# Altium project TE0723.PrjPCB (part 2 of 2)
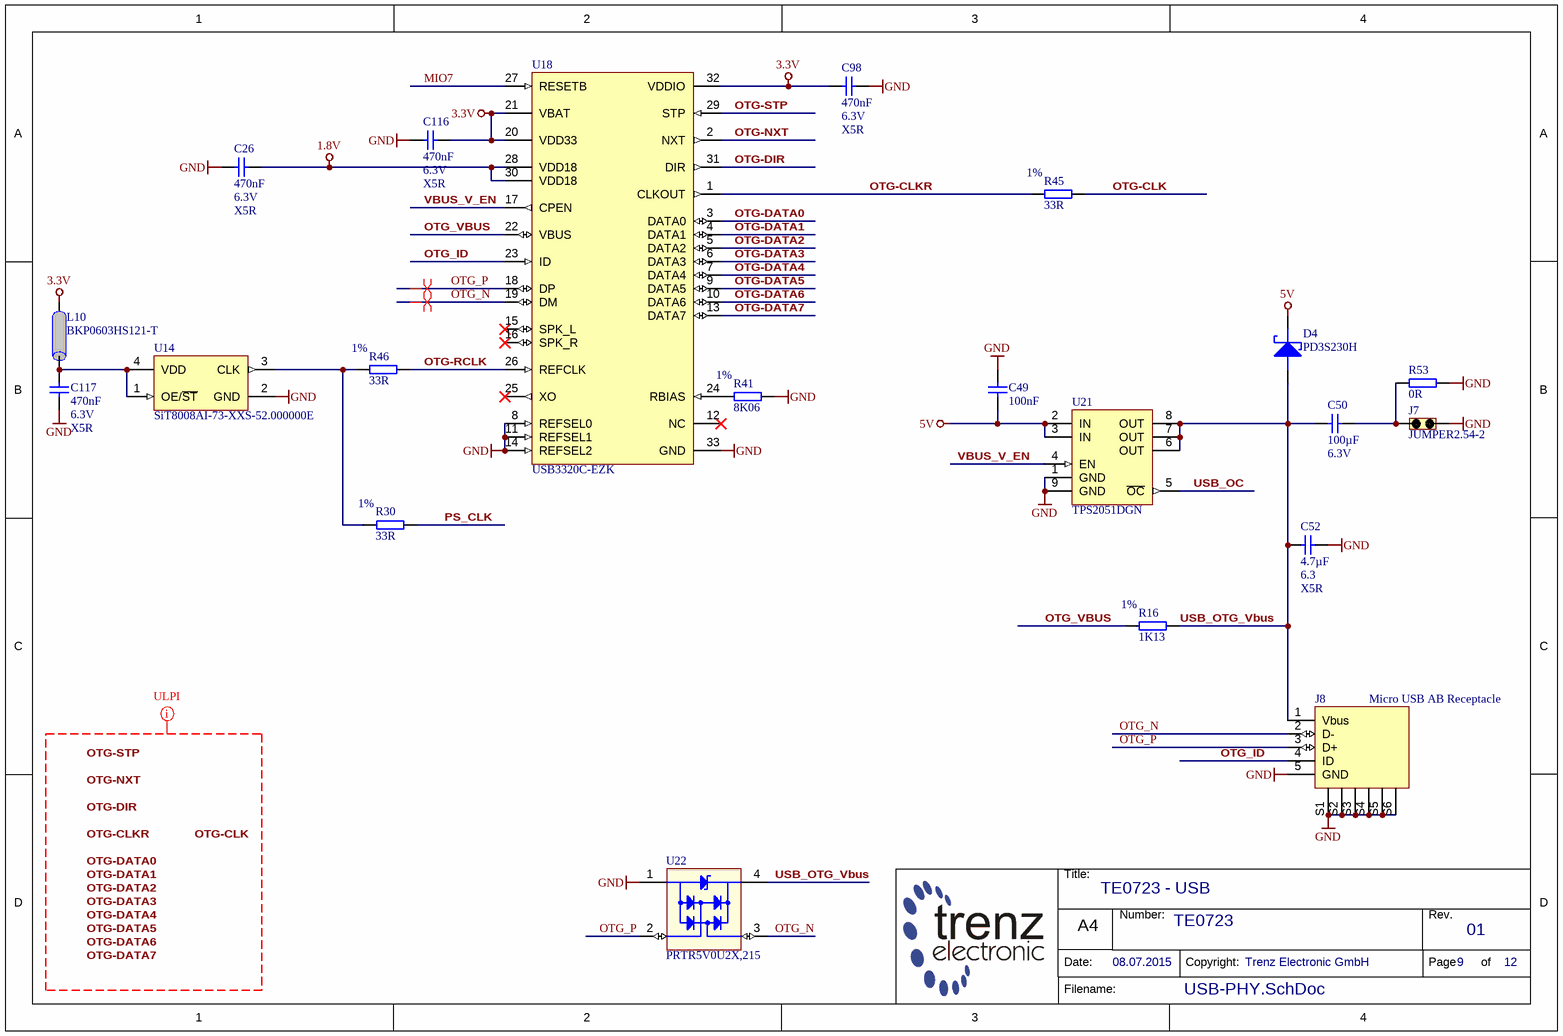
[diagram p12: USB-PHY.SchDoc]

## Nets that join several sheets
1.0V: FPGA_PWR (15 pins), PowerSupply (6 pins)
1.2V: DDR3-RAM (27 pins), FPGA_PWR (7 pins), FPGA_RAM (9 pins), PowerSupply (5 pins)
1.8V: DDR3-RAM (9 pins), FPGA_PWR (15 pins), PowerSupply (6 pins), USB-PHY (C26.1 U18.28 U18.30)
3.3V: A-Headers (12 pins), Analog (L8.1), FPGA_B34 (R35.2 R42.2 R43.1), FPGA_MIO (7 pins), FPGA_PWR (33 pins), FTDI (17 pins), PowerSupply (9 pins), USB-PHY (6 pins)
5V: A-Headers (D5.1 J3.5), PowerSupply (21 pins), USB-PHY (C49.2 D4.1 U21.2 U21.3)
GND: A-Headers (13 pins), Analog (10 pins), DDR3-RAM (35 pins), FPGA_B34 (D6.K R44.2), FPGA_MIO (9 pins), FPGA_PWR (64 pins), FPGA_RAM (10 pins), FTDI (38 pins), PowerSupply (29 pins), USB-PHY (24 pins)
AIN0: A-Headers (J4.1), Analog (U10.13), FPGA_B35 (U1.E13)
AIN1: A-Headers (J4.2), Analog (U10.14), FPGA_B35 (U1.E12)
AIN2: A-Headers (J4.3), Analog (U10.15), FPGA_B35 (U1.F12)
AIN3: A-Headers (J4.4), Analog (U10.12), FPGA_B35 (U1.E11)
AIN4: A-Headers (J4.5), Analog (U10.1), FPGA_B35 (U1.F14)
AIN5: A-Headers (J4.6), Analog (U10.5), FPGA_B35 (U1.F13)
AMUX_S0: Analog (U10.11), FPGA_B34 (U1.G12)
AMUX_S1: Analog (U10.10), FPGA_B34 (U1.G11)
AMUX_S2: Analog (U10.9), FPGA_B34 (U1.H12)
BCBUS0: FPGA_B34 (U1.M14), FTDI (U3.48)
BCBUS1: FPGA_B34 (U1.N14), FTDI (U3.52)
BCBUS2: FPGA_B34 (U1.P15), FTDI (U3.53)
BCBUS3: FPGA_B34 (U1.N13), FTDI (U3.54)
BCBUS4: FPGA_B34 (U1.R15), FTDI (U3.55)
BCBUS7: FPGA_B34 (U1.P14), FTDI (U3.59)
BDBUS0: FPGA_B34 (U1.H13), FTDI (U3.38)
BDBUS1: FPGA_B34 (U1.H14), FTDI (U3.39)
BDBUS2: FPGA_B34 (U1.J15), FTDI (U3.40)
BDBUS3: FPGA_B34 (U1.J14), FTDI (U3.41)
BDBUS4: FPGA_B34 (U1.K15), FTDI (U3.43)
BDBUS5: FPGA_B34 (U1.L15), FTDI (U3.44)
BDBUS6: FPGA_B34 (U1.L14), FTDI (U3.45)
BDBUS7: FPGA_B34 (U1.M15), FTDI (U3.46)
BDDR_VREF: DDR3-RAM (C94.1 C95.1 U8.H10 U8.J2), FPGA_RAM (C66.1 R24.2 R25.1 U1.F4)
CA0: DDR3-RAM (U8.P3), FPGA_RAM (U1.P1)
CA1: DDR3-RAM (U8.N3), FPGA_RAM (U1.N1)
CA2: DDR3-RAM (U8.N2), FPGA_RAM (U1.M1)
CA3: DDR3-RAM (U8.M2), FPGA_RAM (U1.M4)
CA4: DDR3-RAM (U8.M1), FPGA_RAM (U1.P3)
CA5: DDR3-RAM (U8.H2), FPGA_RAM (U1.P4)
CA6: DDR3-RAM (U8.G3), FPGA_RAM (U1.P5)
CA7: DDR3-RAM (U8.G2), FPGA_RAM (U1.M5)
CA8: DDR3-RAM (U8.F2), FPGA_RAM (U1.P6)
CA9: DDR3-RAM (U8.E3), FPGA_RAM (U1.N4)
CK_N: DDR3-RAM (U8.K2), FPGA_RAM (U1.N2)
CK_P: DDR3-RAM (U8.K1), FPGA_RAM (U1.N3)
CKE: DDR3-RAM (U8.P5), FPGA_RAM (U1.L3)
CS: DDR3-RAM (U8.L2), FPGA_RAM (U1.R2)
D2: A-Headers (J2.3), FPGA_B34 (U1.N12)
D3: A-Headers (J2.4), FPGA_B34 (U1.N7)
D4: A-Headers (J2.5), FPGA_B34 (U1.R7)
D5: A-Headers (J2.6), FPGA_B34 (U1.P8)
D6: A-Headers (J2.7), FPGA_B34 (U1.R8)
D7: A-Headers (J2.8), FPGA_B34 (U1.N8)
D8: A-Headers (J1.1), FPGA_B34 (U1.P9)
D9: A-Headers (J1.2), FPGA_B34 (U1.R10)
D10: A-Headers (J1.3), FPGA_B34 (U1.P10)
D11: A-Headers (J1.4), FPGA_B34 (U1.R11)
D12: A-Headers (J1.5), FPGA_B34 (U1.P11)
D13: A-Headers (J1.6), FPGA_B34 (U1.R12)
DM0: DDR3-RAM (U8.J10), FPGA_RAM (U1.B1)
DM1: DDR3-RAM (U8.G10), FPGA_RAM (U1.D3)
DQ0: DDR3-RAM (U8.P7), FPGA_RAM (U1.D4)
DQ1: DDR3-RAM (U8.P8), FPGA_RAM (U1.A2)
DQ2: DDR3-RAM (U8.N10), FPGA_RAM (U1.C4)
DQ3: DDR3-RAM (U8.N9), FPGA_RAM (U1.C1)
DQ4: DDR3-RAM (U8.P9), FPGA_RAM (U1.B4)
DQ5: DDR3-RAM (U8.M10), FPGA_RAM (U1.A4)
DQ6: DDR3-RAM (U8.L10), FPGA_RAM (U1.C3)
DQ7: DDR3-RAM (U8.L9), FPGA_RAM (U1.A3)
DQ8: DDR3-RAM (U8.E9), FPGA_RAM (U1.E1)
DQ9: DDR3-RAM (U8.E10), FPGA_RAM (U1.D1)
DQ10: DDR3-RAM (U8.D10), FPGA_RAM (U1.E2)
DQ11: DDR3-RAM (U8.C9), FPGA_RAM (U1.E3)
DQ12: DDR3-RAM (U8.C10), FPGA_RAM (U1.F3)
DQ13: DDR3-RAM (U8.C11), FPGA_RAM (U1.G1)
DQ14: DDR3-RAM (U8.B9), FPGA_RAM (U1.H1)
DQ15: DDR3-RAM (U8.B8), FPGA_RAM (U1.H2)
DQS0_N: DDR3-RAM (U8.J9), FPGA_RAM (U1.B2)
DQS0_P: DDR3-RAM (U8.K10), FPGA_RAM (U1.C2)
DQS1_N: DDR3-RAM (U8.G9), FPGA_RAM (U1.F2)
DQS1_P: DDR3-RAM (U8.F10), FPGA_RAM (U1.G2)
ESP_GPIO0: A-Headers (J5.3), FPGA_MIO (U1.C13)
ESP_GPIO2: A-Headers (J5.5), FPGA_B35 (U1.G15)
ESP_RXD: A-Headers (J5.7), FPGA_MIO (U1.D13)
ESP_TXD: A-Headers (J5.2), FPGA_MIO (U1.B12)
EXT_RST: A-Headers (J3.3), PowerSupply (D3.1)
MIO7: FPGA_MIO (R39.1 U1.D9), USB-PHY (U18.27)
MOD_RST: A-Headers (J5.6), FPGA_MIO (U1.A12)
OTG-CLK: FPGA_MIO (U1.B14), USB-PHY (R45.2)
OTG-DATA0: FPGA_MIO (U1.E15), USB-PHY (U18.3)
OTG-DATA1: FPGA_MIO (U1.C11), USB-PHY (U18.4)
OTG-DATA2: FPGA_MIO (U1.D15), USB-PHY (U18.5)
OTG-DATA3: FPGA_MIO (U1.A14), USB-PHY (U18.6)
OTG-DATA4: FPGA_MIO (U1.A15), USB-PHY (U18.7)
OTG-DATA5: FPGA_MIO (U1.C14), USB-PHY (U18.9)
OTG-DATA6: FPGA_MIO (U1.A13), USB-PHY (U18.10)
OTG-DATA7: FPGA_MIO (U1.D14), USB-PHY (U18.13)
OTG-DIR: FPGA_MIO (U1.D11), USB-PHY (U18.31)
OTG-NXT: FPGA_MIO (U1.C12), USB-PHY (U18.2)
OTG-STP: FPGA_MIO (U1.B15), USB-PHY (U18.29)
POR_B: FPGA_MIO (U1.C9), PowerSupply (R28.1 U23.3)
PS_CLK: FPGA_MIO (U1.C7), USB-PHY (R30.2)
RST: A-Headers (S1.1 S1.5), PowerSupply (D3.2 R29.1 U23.5)
RXD: A-Headers (J2.1), FPGA_B34 (U1.N11)
SCL: A-Headers (J1.10), FPGA_B34 (R42.1 U1.P13)
SD_CD/MIO0: A-Headers (J10.9 R15.2), FPGA_MIO (U1.D8)
SD_CLK: A-Headers (R12.1), FPGA_MIO (U1.B7)
SD_CMD: A-Headers (J10.3 R11.2), FPGA_MIO (U1.B10)
SD_D0: A-Headers (J10.7 R13.2), FPGA_MIO (U1.D6)
SD_D1: A-Headers (J10.8 R14.2), FPGA_MIO (U1.C6)
SD_D2: A-Headers (J10.1 R5.2), FPGA_MIO (U1.B9)
SD_D3: A-Headers (J10.2 R10.2), FPGA_MIO (U1.D10)
SDA: A-Headers (J1.9), FPGA_B34 (R35.1 U1.R13)
TCK: FPGA_PWR (TP3.1 U1.G9), FTDI (U3.16)
TDI: FPGA_PWR (TP1.1 U1.L7), FTDI (U3.17)
TDO: FPGA_PWR (TP2.1 U1.L8), FTDI (U3.18)
TMS: FPGA_PWR (TP4.1 U1.L9), FTDI (U3.19)
TXD: A-Headers (J2.2), FPGA_B34 (U1.M11)
USB_B_Vbus: A-Headers (D5.2), FTDI (C13.2 J9.1 U4.4)
USB_OC: FPGA_B35 (U1.F15), USB-PHY (U21.5)
V_N: Analog (C28.2 R18.2), FPGA_PWR (U1.H8)
V_P: Analog (C28.1 R17.2), FPGA_PWR (U1.G7)

## Assembly variants
Default: not fitted C99 C100 J7 R35 R42 R43 R53 R53 Y1